# Altium project Data_logger.PrjPcb
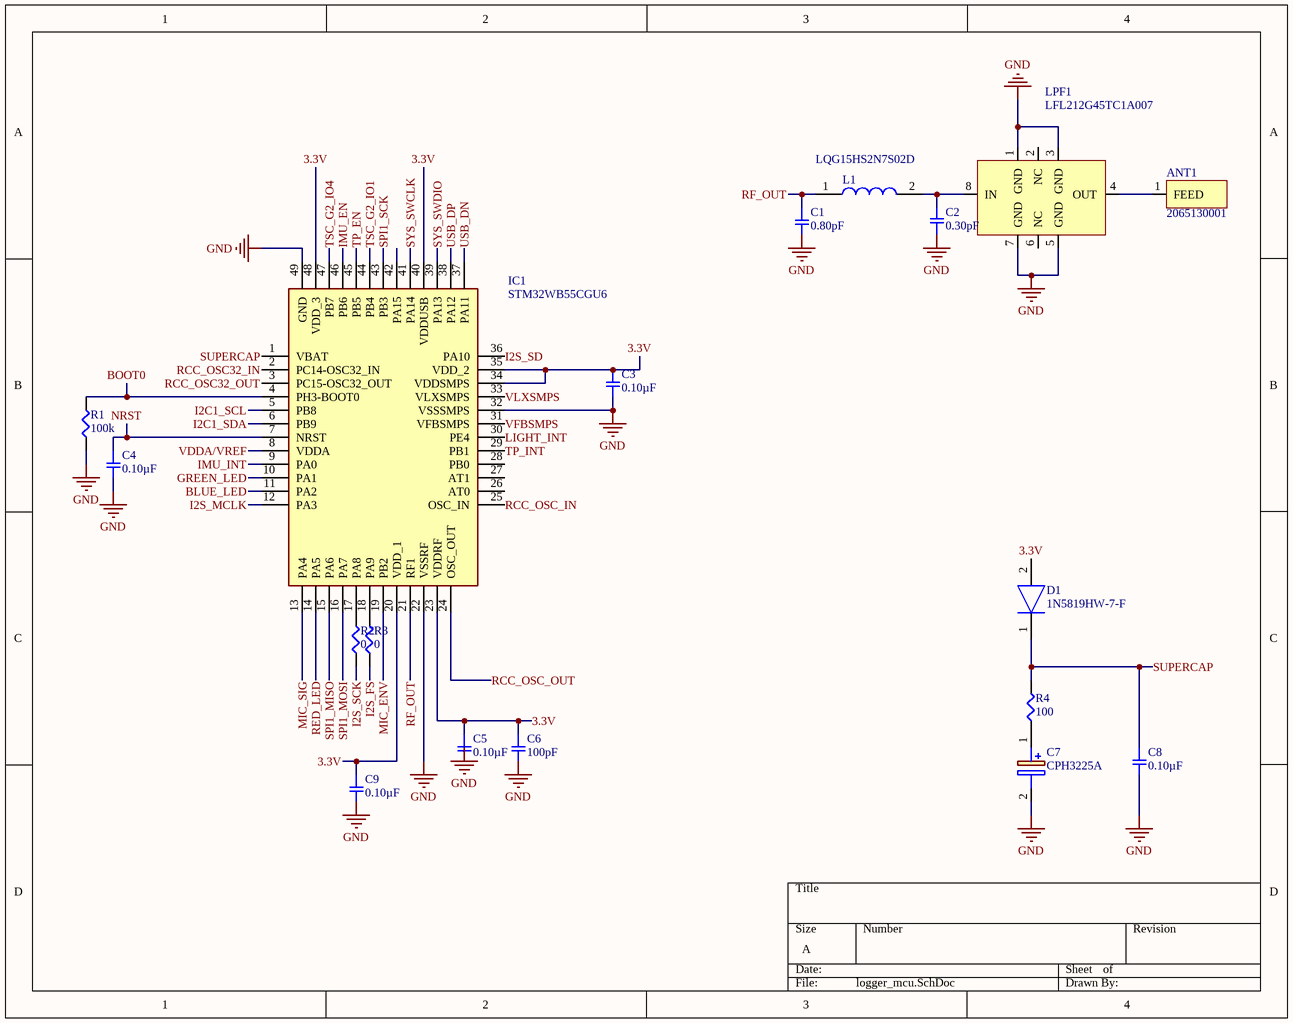
[diagram p0: logger_mcu.SchDoc]
5 sheets, 93 parts. Net scope: global (net labels, ports and power ports of the same name join across sheets).
Board files: Copy of logger_layout_v2.PcbDoc, logger_layout.PcbDoc
Sheets:
  logger_mcu.SchDoc
  logger_sensors.SchDoc
  logger_power.SchDoc
  logger_periph.SchDoc
  logger_connector.SchDoc

## Sheet logger_mcu.SchDoc
size A

### Parts
ANT1  2065130001  [2065130001]
C1  0.80pF  [SMD-0402C]
C2  0.30pF  [SMD-0402C]
C3  0.10µF  [SMD-0402C]
C4  0.10µF  [SMD-0402C]
C5  0.10µF  [SMD-0402C]
C6  100pF  [SMD-0402C]
C7  CPH3225A  [CPH3225A]
C8  0.10µF  [SMD-0402C]
C9  0.10µF  [SMD-0402C]
D1  1N5819HW-7-F  [SOD3716X145N]
IC1  STM32WB55CGU6  [QFN50P700X700X65-49N-D]
L1  LQG15HS2N7S02D  [INDC1005X55N]
LPF1  LFL212G45TC1A007  [LFL212G45TC1A007]
R1  100k  [SMD-0402-RES]
R2  0  [SMD-0402-RES]
R3  0  [SMD-0402-RES]
R4  100  [SMD-0402-RES]

### Nets
GND: C1.2 C2.1 C3.2 C4.2 C6.2 C7.2(-) C8.2 C9.2 IC1.22(VSSRF) IC1.32(VSSSMPS) IC1.49(GND) LPF1.1(GND) LPF1.3(GND) LPF1.5(GND) LPF1.7(GND) R1.1
3.3V: C3.1 C5.1 C6.1 C9.1 D1.2(A) IC1.20(VDD_1) IC1.23(VDDRF) IC1.34(VDDSMPS) IC1.35(VDD_2) IC1.40(VDDUSB) IC1.48(VDD_3)
BLUE_LED: IC1.11(PA2)
BOOT0: IC1.4(PH3-BOOT0) R1.2
GREEN_LED: IC1.10(PA1)
I2C1_SCL: IC1.5(PB8)
I2C1_SDA: IC1.6(PB9)
I2S_FS: R3.1
I2S_MCLK: IC1.12(PA3)
I2S_SCK: R2.1
I2S_SD: IC1.36(PA10)
IMU_EN: IC1.46(PB6)
IMU_INT: IC1.9(PA0)
LIGHT_INT: IC1.30(PE4)
MIC_ENV: IC1.19(PB2)
MIC_SIG: IC1.13(PA4)
NRST: C4.1 IC1.7(NRST)
RCC_OSC32_IN: IC1.2(PC14-OSC32_IN)
RCC_OSC32_OUT: IC1.3(PC15-OSC32_OUT)
RCC_OSC_IN: IC1.25(OSC_IN)
RCC_OSC_OUT: IC1.24(OSC_OUT)
RED_LED: IC1.14(PA5)
RF_OUT: C1.1 IC1.21(RF1) L1.1
SPI1_MISO: IC1.15(PA6)
SPI1_MOSI: IC1.16(PA7)
SPI1_SCK: IC1.43(PB3)
SUPERCAP: C8.1 D1.1(K) IC1.1(VBAT) R4.2
SYS_SWCLK: IC1.41(PA14)
SYS_SWDIO: IC1.39(PA13)
TP_EN: IC1.45(PB5)
TP_INT: IC1.29(PB1)
TSC_G2_IO1: IC1.44(PB4)
TSC_G2_IO4: IC1.47(PB7)
USB_DN: IC1.37(PA11)
USB_DP: IC1.38(PA12)
VDDA/VREF: IC1.8(VDDA)
VFBSMPS: IC1.31(VFBSMPS)
VLXSMPS: IC1.33(VLXSMPS)
NetANT1_1: ANT1.1(FEED) LPF1.4(OUT)
NetC2_2: C2.2 L1.2 LPF1.8(IN)
NetC7_1: C7.1(+) R4.1
NetIC1_17: IC1.17(PA8) R2.2
NetIC1_18: IC1.18(PA9) R3.2

Not connected (* = marked no-connect by the designer): C5 2; IC1 26(AT0) 27(AT1) 28(PB0) 42(PA15); LPF1 2(NC) 6(NC)

### Notes on the sheet
- Labels drawn without touching a wire or pin: GND

### Library data of the parts
C1 = GRM1555C1HR80BA01D: CAP CER 0.8PF 50V NP0 0402; Manufacturer: Murata Electronics North America; Factory Stock: 0; Unit Price (USD): 0.1; Minimum Quantity: 1; Tolerance: ±0.1pF; Temperature Coefficient: C0G, NP0; Datasheets: http://www.murata.com/~/media/webrenewal/support/library/catalog/products/capacitor/mlcc/c02e.pdf; Image: //media.digikey.com/Renders/Murata%20Renders/ZRB-SERIES-0402.jpg; Digi-Key Part Number: 490-6269-1-ND; Part Number: GRM1555C1HR80BA01D; Quantity Available: 38847; @ qty: 0; Packaging: Cut Tape (CT); Series: GRM; Part Status: Active; Value: 0.80pF; Voltage: 50V; Operating Temperature: -55°C ~ 125°C; Features: -; Ratings: -; Applications: General Purpose; Mounting Type: Surface Mount, MLCC; Package / Case: 0402 (1005 Metric); Size / Dimension: 0.039" L x 0.020" W (1.00mm x 0.50mm); Height - Seated (Max): -; Thickness (Max): 0.022" (0.55mm); Lead Spacing: -; Lead Style: -
C2 = GRM1555C1HR30WA01D: CAP CER 0.3PF 50V NP0 0402; Manufacturer: Murata Electronics North America; Factory Stock: 0; Unit Price (USD): 0.16; Minimum Quantity: 1; Tolerance: ±0.05pF; Temperature Coefficient: C0G, NP0; Datasheets: http://www.murata.com/~/media/webrenewal/support/library/catalog/products/capacitor/mlcc/c02e.pdf; Image: //media.digikey.com/Renders/Murata%20Renders/ZRB-SERIES-0402.jpg; Digi-Key Part Number: 490-6261-1-ND; Part Number: GRM1555C1HR30WA01D; Quantity Available: 61475; @ qty: 0; Packaging: Cut Tape (CT); Series: GRM; Part Status: Active; Value: 0.30pF; Voltage: 50V; Operating Temperature: -55°C ~ 125°C; Features: -; Ratings: -; Applications: General Purpose; Mounting Type: Surface Mount, MLCC; Package / Case: 0402 (1005 Metric); Size / Dimension: 0.039" L x 0.020" W (1.00mm x 0.50mm); Height - Seated (Max): -; Thickness (Max): 0.022" (0.55mm); Lead Spacing: -; Lead Style: -
C3-C5 C8 C9 = GCM155R71C104KA55D: CAP CER 0.1UF 16V X7R 0402; Manufacturer: Murata Electronics North America; Factory Stock: 0; Unit Price (USD): 0.1; Minimum Quantity: 1; Tolerance: ±10%; Datasheets: http://www.murata.com/~/media/webrenewal/support/library/catalog/products/capacitor/mlcc/c03e.ashx; Image: //media.digikey.com/Renders/Murata%20Renders/ZRB-SERIES-0402.jpg; Digi-Key Part Number: 490-4759-1-ND; Part Number: GCM155R71C104KA55D; Quantity Available: 734194; @ qty: 0; Packaging: Cut Tape (CT); Series: GCM; Part Status: Active; Value: 0.10µF; Voltage: 16V; Temperature Coefficient: X7R; Operating Temperature: -55°C ~ 125°C; Features: -; Ratings: AEC-Q200; Applications: Automotive; Mounting Type: Surface Mount, MLCC; Package / Case: 0402 (1005 Metric); Size / Dimension: 0.039" L x 0.020" W (1.00mm x 0.50mm); Height - Seated (Max): -; Thickness (Max): 0.022" (0.55mm); Lead Spacing: -; Lead Style: -
C6 = GCM1555C1H101JA16D: CAP CER 100PF 50V NP0 0402; Manufacturer: Murata Electronics North America; Factory Stock: 0; Unit Price (USD): 0.1; Minimum Quantity: 1; Tolerance: ±5%; Temperature Coefficient: C0G, NP0; Datasheets: http://www.murata.com/~/media/webrenewal/support/library/catalog/products/capacitor/mlcc/c03e.ashx; Image: //media.digikey.com/Renders/Murata%20Renders/ZRB-SERIES-0402.jpg; Digi-Key Part Number: 490-10669-1-ND; Part Number: GCM1555C1H101JA16D; Quantity Available: 61397; @ qty: 0; Packaging: Cut Tape (CT); Series: GCM; Part Status: Active; Value: 100pF; Voltage: 50V; Operating Temperature: -55°C ~ 125°C; Features: -; Ratings: AEC-Q200; Applications: Automotive; Mounting Type: Surface Mount, MLCC; Package / Case: 0402 (1005 Metric); Size / Dimension: 0.039" L x 0.020" W (1.00mm x 0.50mm); Height - Seated (Max): -; Thickness (Max): 0.022" (0.55mm); Lead Spacing: -; Lead Style: -
C7 = CPH3225A: Capacitor Polarised; Manufacturer_Name: Seiko Instruments Micro Energy; Datasheet Link: https://www.sii.co.jp/en/me/datasheets/chip-capacitor/cph3225a/; Height: 1mm; Manufacturer_Part_Number: CPH3225A; Mouser Part Number: 628-CPH3225A; Mouser Price/Stock: https://www.mouser.com/Search/Refine.aspx?Keyword=628-CPH3225A
D1 = 1N5819HW-7-F: Diode; Manufacturer_Name: Diodes Inc.; Allied_Number: 70437201; Datasheet Link: http://www.diodes.com/_files/datasheets/ds30217.pdf; Height: 1.45mm; Manufacturer_Part_Number: 1N5819HW-7-F; Mouser Part Number: 621-1N5819HW-F; Mouser Price/Stock: https://www.mouser.com/Search/Refine.aspx?Keyword=621-1N5819HW-F; RS Part Number: 7082197P; RS Price/Stock: http://uk.rs-online.com/web/p/products/7082197P; Allied Price/Stock: http://www.alliedelec.com/diodes-inc-1n5819hw-7-f/70437201/
IC1 = STM32WB55CGU6: Integrated Circuit; Manufacturer_Name: STMicroelectronics; Datasheet Link: https://www.st.com/en/microcontrollers/stm32wb55cg.html; Height: 0.65mm; Manufacturer_Part_Number: STM32WB55CGU6; Mouser Part Number: 511-STM32WB55CGU6; Mouser Price/Stock: https://www.mouser.com/Search/Refine.aspx?Keyword=511-STM32WB55CGU6
L1 = LQG15HS2N7S02D: Inductor; Manufacturer_Name: Murata Electronics; Datasheet Link: https://www.arrow.com/en/products/lqg15hs2n7s02d/murata-manufacturing; Height: 0.55mm; Manufacturer_Part_Number: LQG15HS2N7S02D
R1 = ERJ-2RKF1003X: RES SMD 100K OHM 1% 1/10W 0402; Manufacturer: Panasonic Electronic Components; Factory Stock: 0; Unit Price (USD): 0.00496; @ qty: 1500; Minimum Quantity: 1; Power (Watts): 0.1W, 1/10W; Temperature Coefficient: ±100ppm/°C; Part Number: ERJ-2RKF1003X; Datasheets: http://industrial.panasonic.com/www-cgi/jvcr13pz.cgi?E+PZ+3+AOA0002+ERJ2RKF1003X+7+WW; Image: //media.digikey.com/Photos/Panasonic%20Photos/ERJ-PA2-Series.jpg; Digi-Key Part Number: P100KLCT-ND; Quantity Available: 2645965; Packaging: Cut Tape (CT); Series: ERJ; Part Status: Active; Value: 100k; Tolerance: ±1%; Composition: Thick Film; Features: Automotive AEC-Q200; Operating Temperature: -55°C ~ 155°C; Package / Case: 0402 (1005 Metric); Supplier Device Package: 0402; Size / Dimension: 0.039" L x 0.020" W (1.00mm x 0.50mm); Height - Seated (Max): 0.016" (0.40mm); Number of Terminations: 2; Failure Rate: -
R2 R3 = ERJ-2GEJ103X: RES SMD 0K OHM 5% 1/10W 0402; Manufacturer: Panasonic Electronic Components; Unit Price (USD): 0.00350; @ qty: 1500; Minimum Quantity: 1; Power (Watts): 0.1W, 1/10W; Temperature Coefficient: ±200ppm/°C; Part Number: ERJ-2GEJ103X; Datasheets: http://industrial.panasonic.com/www-cgi/jvcr13pz.cgi?E+PZ+3+AOA0001+ERJ2GEJ103X+7+WW; Image: //media.digikey.com/Photos/Panasonic%20Photos/ERJ-PA2-Series.jpg; Digi-Key Part Number: P10KJCT-ND; Quantity Available: 2560215; Factory Stock: 0; Packaging: Cut Tape (CT); Series: ERJ; Part Status: Active; Value: 0; Tolerance: ±5%; Composition: Thick Film; Features: Automotive AEC-Q200; Operating Temperature: -55°C ~ 155°C; Package / Case: 0402 (1005 Metric); Supplier Device Package: 0402; Size / Dimension: 0.039" L x 0.020" W (1.00mm x 0.50mm); Height - Seated (Max): 0.016" (0.40mm); Number of Terminations: 2; Failure Rate: -
R4 = ERJ-2RKF1003X: RES SMD 100 OHM 5% 1/4W 0603; Manufacturer: Panasonic Electronic Components; Factory Stock: 0; Unit Price (USD): 0.00496; @ qty: 1500; Minimum Quantity: 1; Tolerance: ±1%; Power (Watts): 0.1W, 1/10W; Temperature Coefficient: ±100ppm/°C; Part Number: ERJ-2RKF1003X; Datasheets: http://industrial.panasonic.com/www-cgi/jvcr13pz.cgi?E+PZ+3+AOA0002+ERJ2RKF1003X+7+WW; Image: //media.digikey.com/Photos/Panasonic%20Photos/ERJ-PA2-Series.jpg; Digi-Key Part Number: P100KLCT-ND; Quantity Available: 2645965; Packaging: Cut Tape (CT); Series: ERJ; Part Status: Active; Value: 100; Composition: Thick Film; Features: Automotive AEC-Q200; Operating Temperature: -55°C ~ 155°C; Package / Case: 0603 (1608 Metric); Supplier Device Package: 0603; Size / Dimension: 0.039" L x 0.020" W (1.00mm x 0.50mm); Height - Seated (Max): 0.016" (0.40mm); Number of Terminations: 2; Failure Rate: -

## Sheet logger_sensors.SchDoc
size A
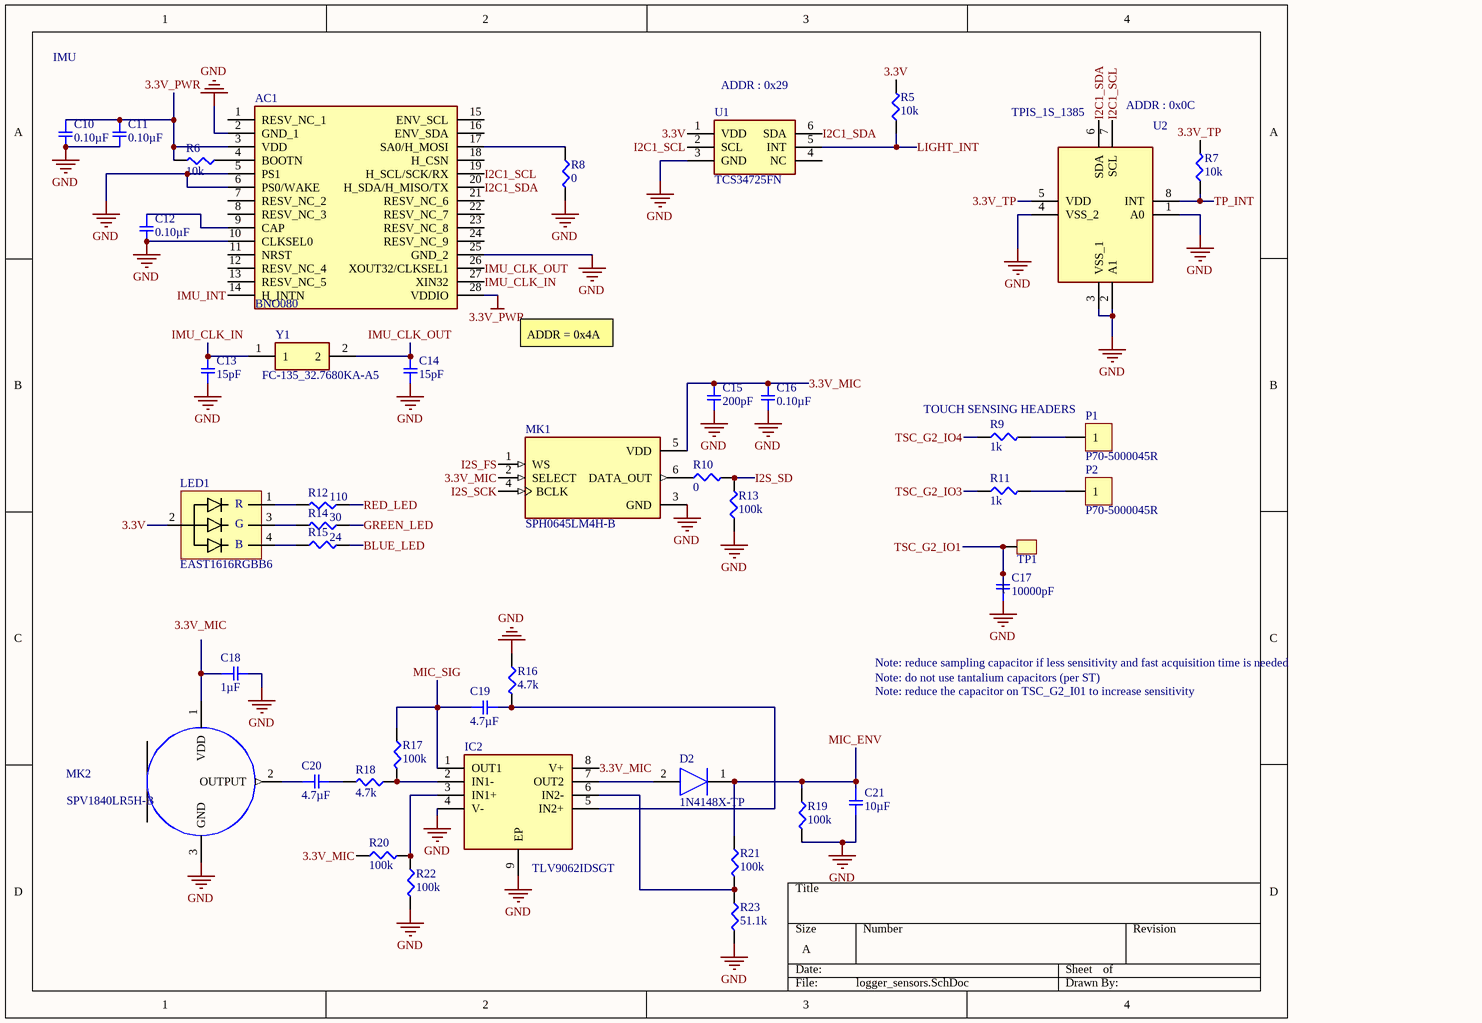
[diagram p1: logger_sensors.SchDoc]

### Parts
AC1  BNO080  [BNO080]
C10  0.10µF  [CAPC1005X55N]
C11  0.10µF  [CAPC1005X55N]
C12  0.10µF  [CAPC1005X55N]
C13  15pF  [CAPC1005X55N]
C14  15pF  [CAPC1005X55N]
C15  200pF  [CAPC1005X55N]
C16  0.10µF  [CAPC1005X55N]
C17  10000pF  [SMD-0402C]
C18  1µF  [SMD-0402C]
C19  4.7µF  [SMD-0402C]
C20  4.7µF  [SMD-0402C]
C21  10µF  [CAPC1005X55N]
D2  1N4148X-TP  [SODFL1608X70N]
IC2  TLV9062IDSGT  [SON50P200X200X80-9N]
LED1  EAST1616RGBB6  [EAST1616RGBB6]
MK1  SPH0645LM4H-B  [MIC_SPH0645LM4H-B]
MK2  SPV1840LR5H-B  [*MIC_SPV1840LR5H-B]
P1  P70-5000045R  [P70-5000045R]
P2  P70-5000045R  [P70-5000045R]
R5  10k  [SMD-0402-RES]
R6  10k  [SMD-0402-RES]
R7  10k  [SMD-0402-RES]
R8  0  [SMD-0402-RES]
R9  1k  [SMD-0402-RES]
R10  0  [SMD-0402-RES]
R11  1k  [SMD-0402-RES]
R12  110  [SMD-0402-RES]
R13  100k  [SMD-0402-RES]
R14  30  [SMD-0402-RES]
R15  24  [SMD-0402-RES]
R16  4.7k  [SMD-0402-RES]
R17  100k  [SMD-0402-RES]
R18  4.7k  [SMD-0402-RES]
R19  100k  [SMD-0402-RES]
R20  100k  [SMD-0402-RES]
R21  100k  [SMD-0402-RES]
R22  100k  [SMD-0402-RES]
R23  51.1k  [SMD-0402-RES]
TP1  TestPoint  [TestPoint_0.4mm]  (value not drawn)
U1  TCS34725FN  [FN_1]
U2  TPIS_1S_1385  [TPIS_1S_1385]  (value not drawn)
Y1  FC-135_32.7680KA-A5  [FC135327680KAAG0]

### Nets
3.3V_PWR: AC1.3(VDD) AC1.28(VDDIO) C10.1 C11.1 R6.2
GND: AC1.2(GND_1) AC1.5(PS1) AC1.6(PS0/WAKE) AC1.10(CLKSEL0) AC1.25(GND_2) C10.2 C11.2 C12.2 C13.2 C14.2 C15.2 C16.2 C17.1 C18.2 C21.2 IC2.4(V-) IC2.9(EP) MK1.3(GND) MK2.3(GND) R8.2 R13.1 R16.1 R19.2 R22.2 R23.2 U1.3(GND) U2.1(A0) U2.2(A1) U2.3(VSS_1) U2.4(VSS_2)
3.3V: LED1.2 R5.2 U1.1(VDD)
3.3V_MIC: C15.1 C16.1 IC2.8(V+) MK1.2(SELECT) MK1.5(VDD) R20.1
3.3V_TP: R7.2 U2.5(VDD)
BLUE_LED: R15.2
GREEN_LED: R14.1
I2C1_SCL: AC1.19(H_SCL/SCK/RX) U1.2(SCL) U2.7(SCL)
I2C1_SDA: AC1.20(H_SDA/H_MISO/TX) U1.6(SDA) U2.6(SDA)
I2S_FS: MK1.1(WS)
I2S_SCK: MK1.4(BCLK)
I2S_SD: R10.2 R13.2
IMU_CLK_IN: AC1.27(XIN32) C13.1 Y1.1
IMU_CLK_OUT: AC1.26(XOUT32/CLKSEL1) C14.1 Y1.2
IMU_INT: AC1.14(H_INTN)
LIGHT_INT: R5.1 U1.5(INT)
MIC_ENV: C21.1 D2.1(K) R19.1 R21.1
MIC_SIG: C19.1 IC2.1(OUT1) R17.1
RED_LED: R12.1
TP_INT: R7.1 U2.8(INT)
TSC_G2_IO1: C17.2 TP1.1
TSC_G2_IO3: R11.1
TSC_G2_IO4: R9.1
NetAC1_4: AC1.4(BOOTN) R6.1
NetAC1_9: AC1.9(CAP) C12.1
NetAC1_17: AC1.17(SA0/H_MOSI) R8.1
NetC18_1: C18.1 MK2.1(VDD)
NetC19_2: C19.2 IC2.5(IN2+) R16.2
NetC20_1: C20.1 MK2.2(OUTPUT)
NetC20_2: C20.2 R18.2
NetD2_2: D2.2(A) IC2.7(OUT2)
NetIC2_2: IC2.2(IN1-) R17.2 R18.1
NetIC2_3: IC2.3(IN1+) R20.2 R22.1
NetIC2_6: IC2.6(IN2-) R21.2 R23.1
NetLED1_1: LED1.1 R12.2
NetLED1_3: LED1.3 R14.2
NetLED1_4: LED1.4 R15.1
NetP1_1: P1.1 R9.2
NetP2_1: P2.1 R11.2

Not connected (* = marked no-connect by the designer): AC1 1(RESV_NC_1) 7(RESV_NC_2) 8(RESV_NC_3) 11(NRST) 12(RESV_NC_4) 13(RESV_NC_5) 15(ENV_SCL) 16(ENV_SDA) 18(H_CSN) 21(RESV_NC_6) 22(RESV_NC_7) 23(RESV_NC_8) 24(RESV_NC_9); MK1 6(DATA_OUT); R10 1; U1 4(NC)

### Notes on the sheet
- IMU
- (near U1) ADDR : 0x29
- (near U2) TPIS_1S_1385
- ADDR : 0x0C
- ADDR = 0x4A
- (near R9) TOUCH SENSING HEADERS
- Note: reduce sampling capacitor if less sensitivity and fast acquisition time is needed
- Note: do not use tantalium capacitors (per ST)
- Note: reduce the capacitor on TSC_G2_I01 to increase sensitivity
- Labels drawn without touching a wire or pin: 3.3V_MIC
- (in symbol EAST1616RGBB6) R; G; B

### Library data of the parts
AC1 = BNO080: Accelerometer; Manufacturer_Name: Hillcrest Laboratories; Datasheet Link: http://www.hillcrestlabs.com/download/5a05f340566d07c196001ec1; Height: 1.18mm; Manufacturer_Part_Number: BNO080
C10-C12 C16 = GCM155R71C104KA55D: as C3 on sheet logger_mcu; Datasheets: http://www.murata.com/~/media/webrenewal/support/library/catalog/products/capacitor/mlcc/c03e.ashx; Image: //media.digikey.com/Renders/Murata%20Renders/ZRB-SERIES-0402.jpg; Digi-Key Part Number: 490-4759-1-ND; Part Number: GCM155R71C104KA55D; Quantity Available: 734194; @ qty: 0; Packaging: Cut Tape (CT); Series: GCM; Part Status: Active; Value: 0.10µF; Voltage: 16V; Temperature Coefficient: X7R; Operating Temperature: -55°C ~ 125°C; Features: -; Ratings: AEC-Q200; Applications: Automotive; Mounting Type: Surface Mount, MLCC; Package / Case: 0402 (1005 Metric); Size / Dimension: 0.039" L x 0.020" W (1.00mm x 0.50mm); Height - Seated (Max): -; Thickness (Max): 0.022" (0.55mm); Lead Spacing: -; Lead Style: -
C13 C14 = GCM1555C1H150JA16D: CAP CER 15PF 50V NP0 0402; Manufacturer: Murata Electronics North America; Factory Stock: 0; Unit Price (USD): 0.1; Minimum Quantity: 1; Tolerance: ±5%; Temperature Coefficient: C0G, NP0; Datasheets: http://www.murata.com/~/media/webrenewal/support/library/catalog/products/capacitor/mlcc/c03e.ashx; Image: //media.digikey.com/Renders/Murata%20Renders/ZRB-SERIES-0402.jpg; Digi-Key Part Number: 490-11147-1-ND; Part Number: GCM1555C1H150JA16D; Quantity Available: 6185; @ qty: 0; Packaging: Cut Tape (CT); Series: GCM; Part Status: Active; Value: 15pF; Voltage: 50V; Operating Temperature: -55°C ~ 125°C; Features: -; Ratings: AEC-Q200; Applications: Automotive; Mounting Type: Surface Mount, MLCC; Package / Case: 0402 (1005 Metric); Size / Dimension: 0.039" L x 0.020" W (1.00mm x 0.50mm); Height - Seated (Max): -; Thickness (Max): 0.022" (0.55mm); Lead Spacing: -; Lead Style: -
C15 = GCM155R71C104KA55D: CAP CER 200pF 16V X7R 0402; Manufacturer: Murata Electronics North America; Factory Stock: 0; Unit Price (USD): 0.1; Minimum Quantity: 1; Tolerance: ±10%; Datasheets: http://www.murata.com/~/media/webrenewal/support/library/catalog/products/capacitor/mlcc/c03e.ashx; Image: //media.digikey.com/Renders/Murata%20Renders/ZRB-SERIES-0402.jpg; Digi-Key Part Number: 490-4759-1-ND; Part Number: GCM155R71C104KA55D; Quantity Available: 734194; @ qty: 0; Packaging: Cut Tape (CT); Series: GCM; Part Status: Active; Value: 200pF; Voltage: 16V; Temperature Coefficient: X7R; Operating Temperature: -55°C ~ 125°C; Features: -; Ratings: AEC-Q200; Applications: Automotive; Mounting Type: Surface Mount, MLCC; Package / Case: 0402 (1005 Metric); Size / Dimension: 0.039" L x 0.020" W (1.00mm x 0.50mm); Height - Seated (Max): -; Thickness (Max): 0.022" (0.55mm); Lead Spacing: -; Lead Style: -
C17 = GCM155R71H103KA55D: CAP CER 10000PF 50V X7R 0402; Manufacturer: Murata Electronics North America; Factory Stock: 0; Unit Price (USD): 0.1; Minimum Quantity: 1; Tolerance: ±10%; Datasheets: http://www.murata.com/~/media/webrenewal/support/library/catalog/products/capacitor/mlcc/c03e.ashx; Image: //media.digikey.com/Renders/Murata%20Renders/ZRB-SERIES-0402.jpg; Digi-Key Part Number: 490-4762-1-ND; Part Number: GCM155R71H103KA55D; Quantity Available: 650067; @ qty: 0; Packaging: Cut Tape (CT); Series: GCM; Part Status: Active; Value: 10000pF; Voltage: 50V; Temperature Coefficient: X7R; Operating Temperature: -55°C ~ 125°C; Features: -; Ratings: AEC-Q200; Applications: Automotive; Mounting Type: Surface Mount, MLCC; Package / Case: 0402 (1005 Metric); Size / Dimension: 0.039" L x 0.020" W (1.00mm x 0.50mm); Height - Seated (Max): -; Thickness (Max): 0.022" (0.55mm); Lead Spacing: -; Lead Style: -
C18 = GCM155C71A105KE38D: CAP CER 1UF 10V X7S 0402; Manufacturer: Murata Electronics North America; Factory Stock: 0; Unit Price (USD): 0.12; Minimum Quantity: 1; Tolerance: ±10%; Datasheets: http://www.murata.com/~/media/webrenewal/support/library/catalog/products/capacitor/mlcc/c03e.ashx; Image: //media.digikey.com/Renders/Murata%20Renders/ZRB-SERIES-0402.jpg; Digi-Key Part Number: 490-13409-1-ND; Part Number: GCM155C71A105KE38D; Quantity Available: 7240; @ qty: 0; Packaging: Cut Tape (CT); Series: GCM; Part Status: Active; Value: 1µF; Voltage: 10V; Temperature Coefficient: X7S; Operating Temperature: -55°C ~ 125°C; Features: -; Ratings: AEC-Q200; Applications: Automotive; Mounting Type: Surface Mount, MLCC; Package / Case: 0402 (1005 Metric); Size / Dimension: 0.039" L x 0.020" W (1.00mm x 0.50mm); Height - Seated (Max): -; Thickness (Max): 0.022" (0.55mm); Lead Spacing: -; Lead Style: -
C19 C20 = GRM155R60J475ME47D: CAP CER 4.7UF 6.3V X5R 0402; Manufacturer: Murata Electronics North America; Factory Stock: 0; Unit Price (USD): 0.14; Minimum Quantity: 1; Tolerance: ±20%; Datasheets: http://www.murata.com/~/media/webrenewal/support/library/catalog/products/capacitor/mlcc/c02e.pdf; Image: //media.digikey.com/Renders/Murata%20Renders/ZRB-SERIES-0402.jpg; Digi-Key Part Number: 490-5915-1-ND; Part Number: GRM155R60J475ME47D; Quantity Available: 1963747; @ qty: 0; Packaging: Cut Tape (CT); Series: GRM; Part Status: Active; Value: 4.7µF; Voltage: 6.3V; Temperature Coefficient: X5R; Operating Temperature: -55°C ~ 85°C; Features: Derating Recommended; Ratings: -; Applications: General Purpose; Mounting Type: Surface Mount, MLCC; Package / Case: 0402 (1005 Metric); Size / Dimension: 0.039" L x 0.020" W (1.00mm x 0.50mm); Height - Seated (Max): -; Thickness (Max): 0.024" (0.60mm); Lead Spacing: -; Lead Style: -
C21 = GCM155R71C104KA55D: CAP CER 10UF 16V X7R 0402; Manufacturer: Murata Electronics North America; Factory Stock: 0; Unit Price (USD): 0.1; Minimum Quantity: 1; Tolerance: ±10%; Datasheets: http://www.murata.com/~/media/webrenewal/support/library/catalog/products/capacitor/mlcc/c03e.ashx; Image: //media.digikey.com/Renders/Murata%20Renders/ZRB-SERIES-0402.jpg; Digi-Key Part Number: 490-4759-1-ND; Part Number: GCM155R71C104KA55D; Quantity Available: 734194; @ qty: 0; Packaging: Cut Tape (CT); Series: GCM; Part Status: Active; Value: 10µF; Voltage: 16V; Temperature Coefficient: X7R; Operating Temperature: -55°C ~ 125°C; Features: -; Ratings: AEC-Q200; Applications: Automotive; Mounting Type: Surface Mount, MLCC; Package / Case: 0402 (1005 Metric); Size / Dimension: 0.039" L x 0.020" W (1.00mm x 0.50mm); Height - Seated (Max): -; Thickness (Max): 0.022" (0.55mm); Lead Spacing: -; Lead Style: -
D2 = 1N4148X-TP: Diode; Manufacturer_Name: Micro Commercial Components (MCC); Datasheet Link: http://www.mouser.com/ds/2/258/1N4148X(SOD-523)-349105.pdf; Height: 0.7mm; Manufacturer_Part_Number: 1N4148X-TP; Mouser Part Number: 833-1N4148X-TP; Mouser Price/Stock: https://www.mouser.com/Search/Refine.aspx?Keyword=833-1N4148X-TP
IC2 = TLV9062IDSGT: Integrated Circuit; Manufacturer_Name: Texas Instruments; Datasheet Link: http://www.ti.com/lit/gpn/TLV9062; Height: 0.8mm; Manufacturer_Part_Number: TLV9062IDSGT; Mouser Part Number: 595-TLV9062IDSGT; Mouser Price/Stock: https://www.mouser.com/Search/Refine.aspx?Keyword=595-TLV9062IDSGT
MK1 = SPH0645LM4H-B: 20 Hz ~ 10 kHz digitale IÂ²S-Mikrofon-MEMS _Silizium_ 1,62 V ~ 3,6 V omnidirektionale _-26 dB Â± 3 dB bei 94 dB SPL_ LÃ¶tpads; MF: Knowles; Package: SIP-7 Bourns; Digi-Key_Purchase_URL: https://www.digikey.ch/product-detail/en/knowles/SPH0645LM4H-B/423-1405-1-ND/5332432?utm_source=snapeda&utm_medium=aggregator&utm_campaign=symbol; Digi-Key_Part_Number: 423-1405-1-ND; SnapEDA_Link: https://www.snapeda.com/parts/SPH0645LM4H-B/Knowles/view-part/229820/?ref=snap; MP: SPH0645LM4H-B; Value: *
MK2 = SPV1840LR5H-B: Mic Mems Analog; MF: Knowles; MP: SPV1840LR5H-B; Package: 0805 Knowles; SnapEDA_Link: https://www.snapeda.com/parts/SPV1840LR5H-B/Knowles/view-part/?ref=snap; Availability: Unavailable; Price: None; Value: *
R5-R7 = ERJ-2GEJ103X: RES SMD 10K OHM 5% 1/10W 0402; Manufacturer: Panasonic Electronic Components; Factory Stock: 0; Unit Price (USD): 0.00350; @ qty: 1500; Minimum Quantity: 1; Power (Watts): 0.1W, 1/10W; Temperature Coefficient: ±200ppm/°C; Part Number: ERJ-2GEJ103X; Datasheets: http://industrial.panasonic.com/www-cgi/jvcr13pz.cgi?E+PZ+3+AOA0001+ERJ2GEJ103X+7+WW; Image: //media.digikey.com/Photos/Panasonic%20Photos/ERJ-PA2-Series.jpg; Digi-Key Part Number: P10KJCT-ND; Quantity Available: 2560215; Packaging: Cut Tape (CT); Series: ERJ; Part Status: Active; Value: 10k; Tolerance: ±5%; Composition: Thick Film; Features: Automotive AEC-Q200; Operating Temperature: -55°C ~ 155°C; Package / Case: 0402 (1005 Metric); Supplier Device Package: 0402; Size / Dimension: 0.039" L x 0.020" W (1.00mm x 0.50mm); Height - Seated (Max): 0.016" (0.40mm); Number of Terminations: 2; Failure Rate: -
R8 R10 = ERJ-2GEJ103X: as R2 on sheet logger_mcu; Part Number: ERJ-2GEJ103X; Datasheets: http://industrial.panasonic.com/www-cgi/jvcr13pz.cgi?E+PZ+3+AOA0001+ERJ2GEJ103X+7+WW; Image: //media.digikey.com/Photos/Panasonic%20Photos/ERJ-PA2-Series.jpg; Digi-Key Part Number: P10KJCT-ND; Quantity Available: 2560215; Factory Stock: 0; Packaging: Cut Tape (CT); Series: ERJ; Part Status: Active; Value: 0; Tolerance: ±5%; Composition: Thick Film; Features: Automotive AEC-Q200; Operating Temperature: -55°C ~ 155°C; Package / Case: 0402 (1005 Metric); Supplier Device Package: 0402; Size / Dimension: 0.039" L x 0.020" W (1.00mm x 0.50mm); Height - Seated (Max): 0.016" (0.40mm); Number of Terminations: 2; Failure Rate: -
R9 R11 = ERJ-2GEJ102X: RES SMD 1K OHM 5% 1/10W 0402; Manufacturer: Panasonic Electronic Components; Factory Stock: 0; Unit Price (USD): 0.00350; @ qty: 1500; Minimum Quantity: 1; Power (Watts): 0.1W, 1/10W; Temperature Coefficient: ±200ppm/°C; Part Number: ERJ-2GEJ102X; Datasheets: http://industrial.panasonic.com/www-cgi/jvcr13pz.cgi?E+PZ+3+AOA0001+ERJ2GEJ102X+7+WW; Image: //media.digikey.com/Photos/Panasonic%20Photos/ERJ-PA2-Series.jpg; Digi-Key Part Number: P1.0KJCT-ND; Quantity Available: 1939857; Packaging: Cut Tape (CT); Series: ERJ; Part Status: Active; Value: 1k; Tolerance: ±5%; Composition: Thick Film; Features: Automotive AEC-Q200; Operating Temperature: -55°C ~ 155°C; Package / Case: 0402 (1005 Metric); Supplier Device Package: 0402; Size / Dimension: 0.039" L x 0.020" W (1.00mm x 0.50mm); Height - Seated (Max): 0.016" (0.40mm); Number of Terminations: 2; Failure Rate: -
R12 R14 R15 = ERJ-2GEJ103X: RES SMD 110 OHM 5% 1/10W 0402; Manufacturer: Panasonic Electronic Components; Factory Stock: 0; Unit Price (USD): 0.00350; @ qty: 1500; Minimum Quantity: 1; Power (Watts): 0.1W, 1/10W; Temperature Coefficient: ±200ppm/°C; Part Number: ERJ-2GEJ103X; Datasheets: http://industrial.panasonic.com/www-cgi/jvcr13pz.cgi?E+PZ+3+AOA0001+ERJ2GEJ103X+7+WW; Image: //media.digikey.com/Photos/Panasonic%20Photos/ERJ-PA2-Series.jpg; Digi-Key Part Number: P10KJCT-ND; Quantity Available: 2560215; Packaging: Cut Tape (CT); Series: ERJ; Part Status: Active; Tolerance: ±5%; Composition: Thick Film; Features: Automotive AEC-Q200; Operating Temperature: -55°C ~ 155°C; Package / Case: 0402 (1005 Metric); Supplier Device Package: 0402; Size / Dimension: 0.039" L x 0.020" W (1.00mm x 0.50mm); Height - Seated (Max): 0.016" (0.40mm); Number of Terminations: 2; Failure Rate: -
  R12: Value: 110
  R14: Value: 30
  R15: Value: 24
R13 R17 R19-R22 = ERJ-2GEJ103X: RES SMD 100K OHM 5% 1/10W 0402; Manufacturer: Panasonic Electronic Components; Factory Stock: 0; Unit Price (USD): 0.00350; @ qty: 1500; Minimum Quantity: 1; Power (Watts): 0.1W, 1/10W; Temperature Coefficient: ±200ppm/°C; Part Number: ERJ-2GEJ103X; Datasheets: http://industrial.panasonic.com/www-cgi/jvcr13pz.cgi?E+PZ+3+AOA0001+ERJ2GEJ103X+7+WW; Image: //media.digikey.com/Photos/Panasonic%20Photos/ERJ-PA2-Series.jpg; Digi-Key Part Number: P10KJCT-ND; Quantity Available: 2560215; Packaging: Cut Tape (CT); Series: ERJ; Part Status: Active; Value: 100k; Tolerance: ±5%; Composition: Thick Film; Features: Automotive AEC-Q200; Operating Temperature: -55°C ~ 155°C; Package / Case: 0402 (1005 Metric); Supplier Device Package: 0402; Size / Dimension: 0.039" L x 0.020" W (1.00mm x 0.50mm); Height - Seated (Max): 0.016" (0.40mm); Number of Terminations: 2; Failure Rate: -
R16 R18 = ERJ-2GEJ103X: RES SMD 4.7K OHM 5% 1/10W 0402; Manufacturer: Panasonic Electronic Components; Factory Stock: 0; Unit Price (USD): 0.00350; @ qty: 1500; Minimum Quantity: 1; Power (Watts): 0.1W, 1/10W; Temperature Coefficient: ±200ppm/°C; Part Number: ERJ-2GEJ103X; Datasheets: http://industrial.panasonic.com/www-cgi/jvcr13pz.cgi?E+PZ+3+AOA0001+ERJ2GEJ103X+7+WW; Image: //media.digikey.com/Photos/Panasonic%20Photos/ERJ-PA2-Series.jpg; Digi-Key Part Number: P10KJCT-ND; Quantity Available: 2560215; Packaging: Cut Tape (CT); Series: ERJ; Part Status: Active; Value: 4.7k; Tolerance: ±5%; Composition: Thick Film; Features: Automotive AEC-Q200; Operating Temperature: -55°C ~ 155°C; Package / Case: 0402 (1005 Metric); Supplier Device Package: 0402; Size / Dimension: 0.039" L x 0.020" W (1.00mm x 0.50mm); Height - Seated (Max): 0.016" (0.40mm); Number of Terminations: 2; Failure Rate: -
R23 = ERJ-2GEJ103X: RES SMD 51.1K OHM 5% 1/10W 0402; Manufacturer: Panasonic Electronic Components; Factory Stock: 0; Unit Price (USD): 0.00350; @ qty: 1500; Minimum Quantity: 1; Power (Watts): 0.1W, 1/10W; Temperature Coefficient: ±200ppm/°C; Part Number: ERJ-2GEJ103X; Datasheets: http://industrial.panasonic.com/www-cgi/jvcr13pz.cgi?E+PZ+3+AOA0001+ERJ2GEJ103X+7+WW; Image: //media.digikey.com/Photos/Panasonic%20Photos/ERJ-PA2-Series.jpg; Digi-Key Part Number: P10KJCT-ND; Quantity Available: 2560215; Packaging: Cut Tape (CT); Series: ERJ; Part Status: Active; Value: 51.1k; Tolerance: ±5%; Composition: Thick Film; Features: Automotive AEC-Q200; Operating Temperature: -55°C ~ 155°C; Package / Case: 0402 (1005 Metric); Supplier Device Package: 0402; Size / Dimension: 0.039" L x 0.020" W (1.00mm x 0.50mm); Height - Seated (Max): 0.016" (0.40mm); Number of Terminations: 2; Failure Rate: -
U1 = TCS34725FN: Undefined or Miscellaneous; Manufacturer_Name: ams; Datasheet Link: https://ams.com/jpn/content/download/319364/1117183/file/TCS3472_Datasheet_EN_v2.pdf; Manufacturer_Part_Number: TCS34725FN; Mouser Part Number: 985-TCS34725FN; Mouser Price/Stock: https://www.mouser.com/Search/Refine.aspx?Keyword=985-TCS34725FN; RS Part Number: 1024173P; RS Price/Stock: http://china.rs-online.com/web/p/products/1024173P
U2 = TPIS_1S_1385: Undefined or Miscellaneous; Manufacturer_Name: Excelitas Technologies; Manufacturer_Part_Number: TPIS 1S 1385; Datasheet Link: http://media.digikey.com/pdf/Data%20Sheets/Excelitas%20PDFs/TPiS_1S_1385.pdf
Y1 = FC-135_32.7680KA-A3: Crystal or Oscillator; Manufacturer_Name: Epson Timing; Manufacturer_Part_Number: FC-135 32.7680KA-A5; Datasheet Link: https://support.epson.biz/td/api/doc_check.php?dl=brief_fc-135r_en.pdf; Height: 0mm; Mouser Part Number: 732-FC135-32.76KAA3; Mouser Price/Stock: https://www.mouser.com/Search/Refine.aspx?Keyword=732-FC135-32.76KAA3

## Sheet logger_power.SchDoc
size A
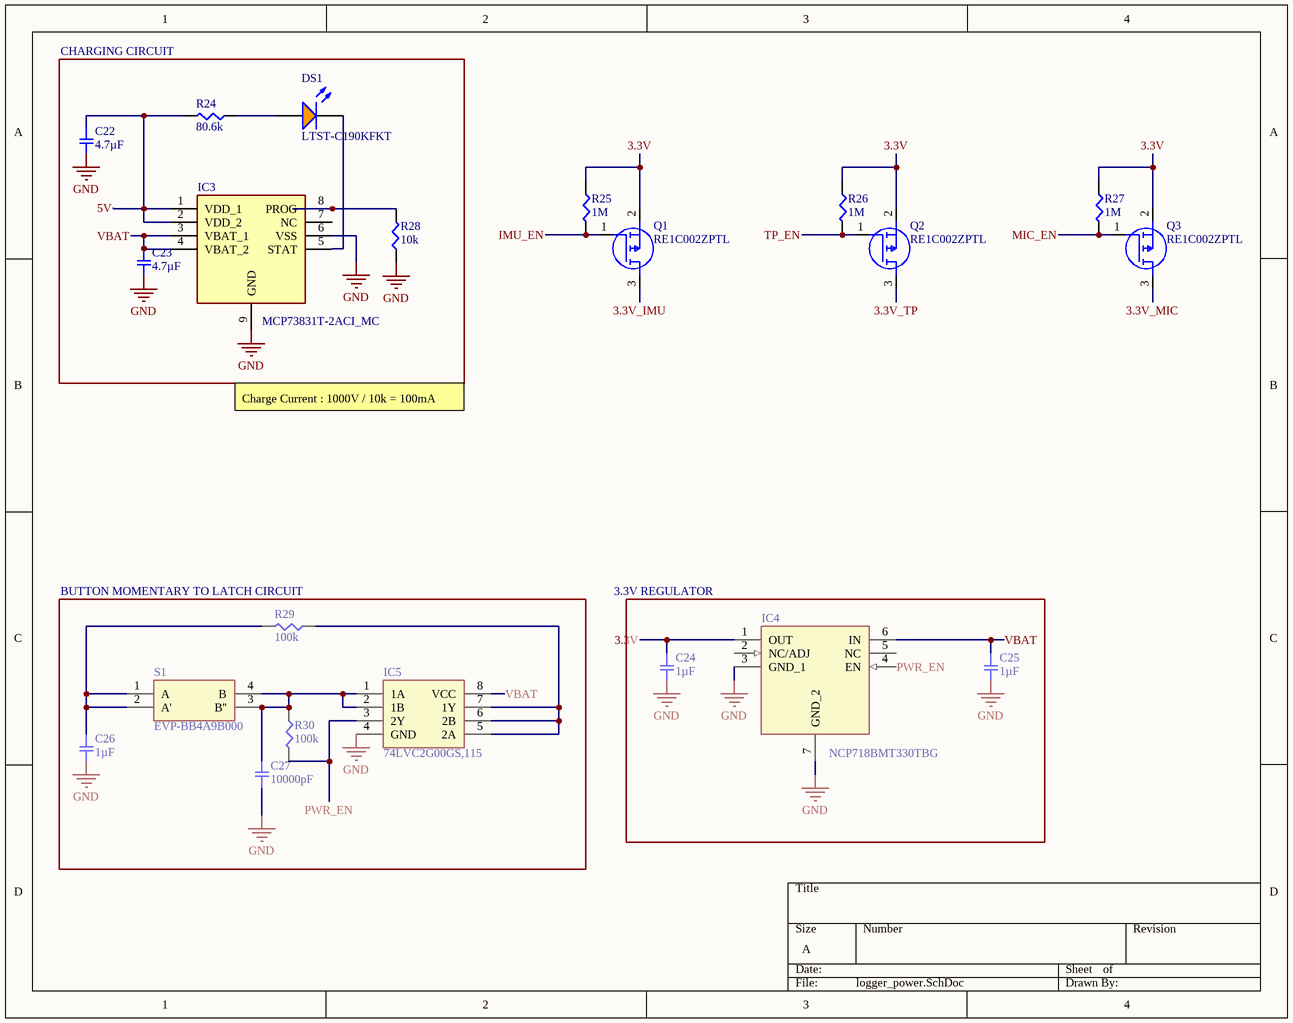
[diagram p2: logger_power.SchDoc]

### Parts
C22  4.7µF  [SMD-0402C]
C23  4.7µF  [SMD-0402C]
C24  1µF  [SMD-0402C]
C25  1µF  [SMD-0402C]
C26  1µF  [SMD-0402C]
C27  10000pF  [SMD-0402C]
DS1  LTST-C190KFKT  [LTST-C190KFKT_V]
IC3  MCP73831T-2ACI_MC  [SON65P300X300X100-9N-D]
IC4  NCP718BMT330TBG  [SON65P200X200X80-7N]
IC5  74LVC2G00GS,115  [74AXP2T3407GSX]
Q1  RE1C002ZPTL  [SOTFL50P160X85-3N]
Q2  RE1C002ZPTL  [SOTFL50P160X85-3N]
Q3  RE1C002ZPTL  [SOTFL50P160X85-3N]
R24  80.6k  [SMD-0402-RES]
R25  1M  [SMD-0402-RES]
R26  1M  [SMD-0402-RES]
R27  1M  [SMD-0402-RES]
R28  10k  [SMD-0402-RES]
R29  100k  [SMD-0402-RES]
R30  100k  [SMD-0402-RES]
S1  EVP-BB4A9B000  [EVPBB2A9B000]

### Blocks framed on the sheet
CHARGING CIRCUIT: C22 C23 DS1 IC3 R24 R28
BUTTON MOMENTARY TO LATCH CIRCUIT: C26 C27 IC5 R29 R30 S1

### Nets
GND: C22.2 C23.2 C24.2 C25.2 C26.2 C27.1 IC3.6(VSS) IC3.9(GND) IC4.3(GND_1) IC4.7(GND_2) IC5.4(GND) R28.1
3.3V: C24.1 IC4.1(OUT) Q1.2(S) Q2.2(S) Q3.2(S) R25.1 R26.1 R27.1
3.3V_IMU: Q1.3(D)
3.3V_MIC: Q3.3(D)
3.3V_TP: Q2.3(D)
5V: C22.1 IC3.1(VDD_1) IC3.2(VDD_2) R24.2
IMU_EN: Q1.1(G) R25.2
MIC_EN: Q3.1(G) R27.2
PWR_EN: IC4.4(EN) IC5.3(2Y) R30.2
TP_EN: Q2.1(G) R26.2
VBAT: C23.1 C25.1 IC3.3(VBAT_1) IC3.4(VBAT_2) IC4.6(IN) IC5.8(VCC)
NetC26_1: C26.1 R29.2 S1.1(A) S1.2(A')
NetC27_2: C27.2 IC5.1(1A) IC5.2(1B) R30.1 S1.3(B'') S1.4(B)
NetDS1_1: DS1.1(A) R24.1
NetDS1_2: DS1.2(K) IC3.5(STAT)
NetIC3_8: IC3.8(PROG) R28.2
NetIC5_5: IC5.5(2A) IC5.6(2B) IC5.7(1Y) R29.1

Not connected (* = marked no-connect by the designer): IC3 7(NC); IC4 2(NC/ADJ) 5(NC)

### Notes on the sheet
- Charge Current : 1000V / 10k = 100mA
- 3.3V REGULATOR

### Library data of the parts
C22 C23 = GRM153R60G475ME15D: CAP CER 4.7UF 4V X5R 0402; Manufacturer: Murata Electronics North America; Factory Stock: 0; Unit Price (USD): 0.27; Minimum Quantity: 1; Tolerance: ±20%; Datasheets: http://psearch.en.murata.com/capacitor/product/GRM153R60G475ME15%23.pdf; Image: //media.digikey.com/Renders/Murata%20Renders/ZRB-SERIES-0402.jpg; Digi-Key Part Number: 490-13231-1-ND; Part Number: GRM153R60G475ME15D; Quantity Available: 9100; @ qty: 0; Packaging: Cut Tape (CT); Series: GRM; Part Status: Active; Value: 4.7µF; Voltage: 4V; Temperature Coefficient: X5R; Operating Temperature: -55°C ~ 85°C; Features: -; Ratings: -; Applications: General Purpose; Mounting Type: Surface Mount, MLCC; Package / Case: 0402 (1005 Metric); Size / Dimension: 0.039" L x 0.020" W (1.00mm x 0.50mm); Height - Seated (Max): -; Thickness (Max): 0.013" (0.33mm); Lead Spacing: -; Lead Style: -
C24-C26 = GCM155C71A105KE38D: as C18 on sheet logger_sensors; Datasheets: http://www.murata.com/~/media/webrenewal/support/library/catalog/products/capacitor/mlcc/c03e.ashx; Image: //media.digikey.com/Renders/Murata%20Renders/ZRB-SERIES-0402.jpg; Digi-Key Part Number: 490-13409-1-ND; Part Number: GCM155C71A105KE38D; Quantity Available: 7240; @ qty: 0; Packaging: Cut Tape (CT); Series: GCM; Part Status: Active; Value: 1µF; Voltage: 10V; Temperature Coefficient: X7S; Operating Temperature: -55°C ~ 125°C; Features: -; Ratings: AEC-Q200; Applications: Automotive; Mounting Type: Surface Mount, MLCC; Package / Case: 0402 (1005 Metric); Size / Dimension: 0.039" L x 0.020" W (1.00mm x 0.50mm); Height - Seated (Max): -; Thickness (Max): 0.022" (0.55mm); Lead Spacing: -; Lead Style: -
C27 = GCM155R71H103KA55D: as C17 on sheet logger_sensors; Datasheets: http://www.murata.com/~/media/webrenewal/support/library/catalog/products/capacitor/mlcc/c03e.ashx; Image: //media.digikey.com/Renders/Murata%20Renders/ZRB-SERIES-0402.jpg; Digi-Key Part Number: 490-4762-1-ND; Part Number: GCM155R71H103KA55D; Quantity Available: 650067; @ qty: 0; Packaging: Cut Tape (CT); Series: GCM; Part Status: Active; Value: 10000pF; Voltage: 50V; Temperature Coefficient: X7R; Operating Temperature: -55°C ~ 125°C; Features: -; Ratings: AEC-Q200; Applications: Automotive; Mounting Type: Surface Mount, MLCC; Package / Case: 0402 (1005 Metric); Size / Dimension: 0.039" L x 0.020" W (1.00mm x 0.50mm); Height - Seated (Max): -; Thickness (Max): 0.022" (0.55mm); Lead Spacing: -; Lead Style: -
DS1 = CMP-1674-00008-1: LED Uni-Color Orange, 75 mW, 30 mA, -35 to 85 degC, 2-Pin SMD, RoHS, Tape and Reel; Resistance: 47 kohm; Power Rating: 100 mW; Case\Package: 0603; Tolerance: 1%; Voltage Rating (DC): 50 V; ComponentLink2URL: http://optoelectronics.liteon.com/upload/download/DS-22-99-0186/S_110_LTST-C190KFKT.pdf; Mount: Surface Mount; Pins: 2; Package Quantity: 5000; Max Operating Temperature: 155 degC; RoHSCompliant: true; PackageDescription: 2-Pin Surface Mount Device, Body 1.6 x 0.8 mm; Case Code (Metric): 1608; PackageReference: C190KFKT; Height: 0.45 mm; ComponentLink2Description: Datasheet; Min Operating Temperature: -55 degC; DatasheetVersion: Rev. I, 09/2011; Packaging: Tape and Reel; ComponentLink1Description: Manufacturer URL; ComponentLink1URL: http://www.us.liteon.com/; Voltage Rating: 50 V; Case Code (Imperial): 0603; Length: 1.6 mm; Width: 0.8 mm; REACH SVHC: No SVHC
IC3 = MCP73831T-2ACI_MC: Integrated Circuit; Manufacturer_Name: Microchip; Manufacturer_Part_Number: MCP73831T-2ACI/MC; Allied_Number: 70452042; Datasheet Link: http://ww1.microchip.com/downloads/en/DeviceDoc/20001984g.pdf; Height: 1mm; Mouser Part Number: 579-MCP73831T-2ACIMC; Mouser Price/Stock: https://www.mouser.com/Search/Refine.aspx?Keyword=579-MCP73831T-2ACIMC; Allied Price/Stock: https://www.alliedelec.com/microchiptechnologyinc-mcp73831t-2aci-mc/70452042/
IC4 = NCP718BMT330TBG: Integrated Circuit; Manufacturer_Name: ON Semiconductor; Datasheet Link: https://componentsearchengine.com/Datasheets/1/NCP718BMT330TBG.pdf; Height: 0.8mm; Manufacturer_Part_Number: NCP718BMT330TBG; Mouser Part Number: 863-NCP718BMT330TBG; Mouser Price/Stock: https://www.mouser.com/Search/Refine.aspx?Keyword=863-NCP718BMT330TBG; RS Part Number: 1861278; RS Price/Stock: http://uk.rs-online.com/web/p/products/1861278
IC5 = 74LVC2G00GS,115: Integrated Circuit; Manufacturer_Name: Nexperia; Datasheet Link: https://assets.nexperia.com/documents/data-sheet/74LVC2G00.pdf; Height: 0.35mm; Manufacturer_Part_Number: 74LVC2G00GS,115
Q1-Q3 = RE1C002ZPTL: MOSFET (P-Channel); Manufacturer_Name: ROHM Semiconductor; Datasheet Link: https://componentsearchengine.com/Datasheets/1/RE1C002ZPTL.pdf; Height: 0.85mm; Manufacturer_Part_Number: RE1C002ZPTL; Mouser Part Number: 755-RE1C002ZPTL; Mouser Price/Stock: https://www.mouser.com/Search/Refine.aspx?Keyword=755-RE1C002ZPTL; RS Part Number: 1486960P; RS Price/Stock: http://uk.rs-online.com/web/p/products/1486960P
R24 = ERJ-2RKF8062X: RES SMD 80.6K OHM 1% 1/10W 0402; Manufacturer: Panasonic Electronic Components; Factory Stock: 0; Unit Price (USD): 0.00496; @ qty: 1500; Minimum Quantity: 1; Power (Watts): 0.1W, 1/10W; Temperature Coefficient: ±100ppm/°C; Part Number: ERJ-2RKF8062X; Datasheets: http://industrial.panasonic.com/www-cgi/jvcr13pz.cgi?E+PZ+3+AOA0002+ERJ2RKF8062X+7+WW; Image: //media.digikey.com/Photos/Panasonic%20Photos/ERJ-PA2-Series.jpg; Digi-Key Part Number: P80.6KLCT-ND; Quantity Available: 91747; Packaging: Cut Tape (CT); Series: ERJ; Part Status: Active; Value: 80.6k; Tolerance: ±1%; Composition: Thick Film; Features: Automotive AEC-Q200; Operating Temperature: -55°C ~ 155°C; Package / Case: 0402 (1005 Metric); Supplier Device Package: 0402; Size / Dimension: 0.039" L x 0.020" W (1.00mm x 0.50mm); Height - Seated (Max): 0.016" (0.40mm); Number of Terminations: 2; Failure Rate: -
R25-R27 = ERJ-2GEJ105X: RES SMD 1M OHM 5% 1/10W 0402; Manufacturer: Panasonic Electronic Components; Factory Stock: 0; Unit Price (USD): 0.00350; @ qty: 1500; Minimum Quantity: 1; Power (Watts): 0.1W, 1/10W; Temperature Coefficient: ±200ppm/°C; Part Number: ERJ-2GEJ105X; Datasheets: http://industrial.panasonic.com/www-cgi/jvcr13pz.cgi?E+PZ+3+AOA0001+ERJ2GEJ105X+7+WW; Image: //media.digikey.com/Photos/Panasonic%20Photos/ERJ-PA2-Series.jpg; Digi-Key Part Number: P1.0MJCT-ND; Quantity Available: 1082572; Packaging: Cut Tape (CT); Series: ERJ; Part Status: Active; Value: 1M; Tolerance: ±5%; Composition: Thick Film; Features: Automotive AEC-Q200; Operating Temperature: -55°C ~ 155°C; Package / Case: 0402 (1005 Metric); Supplier Device Package: 0402; Size / Dimension: 0.039" L x 0.020" W (1.00mm x 0.50mm); Height - Seated (Max): 0.016" (0.40mm); Number of Terminations: 2; Failure Rate: -
R28 = ERJ-2GEJ103X: as R5 on sheet logger_sensors; Part Number: ERJ-2GEJ103X; Datasheets: http://industrial.panasonic.com/www-cgi/jvcr13pz.cgi?E+PZ+3+AOA0001+ERJ2GEJ103X+7+WW; Image: //media.digikey.com/Photos/Panasonic%20Photos/ERJ-PA2-Series.jpg; Digi-Key Part Number: P10KJCT-ND; Quantity Available: 2560215; Packaging: Cut Tape (CT); Series: ERJ; Part Status: Active; Value: 10k; Tolerance: ±5%; Composition: Thick Film; Features: Automotive AEC-Q200; Operating Temperature: -55°C ~ 155°C; Package / Case: 0402 (1005 Metric); Supplier Device Package: 0402; Size / Dimension: 0.039" L x 0.020" W (1.00mm x 0.50mm); Height - Seated (Max): 0.016" (0.40mm); Number of Terminations: 2; Failure Rate: -
R29 R30 = ERJ-2GEJ104X: RES SMD 100K OHM 5% 1/10W 0402; Manufacturer: Panasonic Electronic Components; Factory Stock: 0; Unit Price (USD): 0.00350; @ qty: 1500; Minimum Quantity: 1; Power (Watts): 0.1W, 1/10W; Temperature Coefficient: ±200ppm/°C; Part Number: ERJ-2GEJ104X; Datasheets: http://industrial.panasonic.com/www-cgi/jvcr13pz.cgi?E+PZ+3+AOA0001+ERJ2GEJ104X+7+WW; Image: //media.digikey.com/Photos/Panasonic%20Photos/ERJ-PA2-Series.jpg; Digi-Key Part Number: P100KJCT-ND; Quantity Available: 2387986; Packaging: Cut Tape (CT); Series: ERJ; Part Status: Active; Value: 100k; Tolerance: ±5%; Composition: Thick Film; Features: Automotive AEC-Q200; Operating Temperature: -55°C ~ 155°C; Package / Case: 0402 (1005 Metric); Supplier Device Package: 0402; Size / Dimension: 0.039" L x 0.020" W (1.00mm x 0.50mm); Height - Seated (Max): 0.016" (0.40mm); Number of Terminations: 2; Failure Rate: -
S1 = EVP-BB4A9B000: Switch; Manufacturer_Name: Panasonic; Datasheet Link: https://industrial.panasonic.com/ac/cdn/e/control/switch/light-touch/catalog/sw_lt_eng_2616s.pdf; Height: 0mm; Manufacturer_Part_Number: EVP-BB4A9B000; Mouser Part Number: 667-EVP-BB4A9B000; Mouser Price/Stock: https://www.mouser.com/Search/Refine.aspx?Keyword=667-EVP-BB4A9B000

## Sheet logger_periph.SchDoc
size A
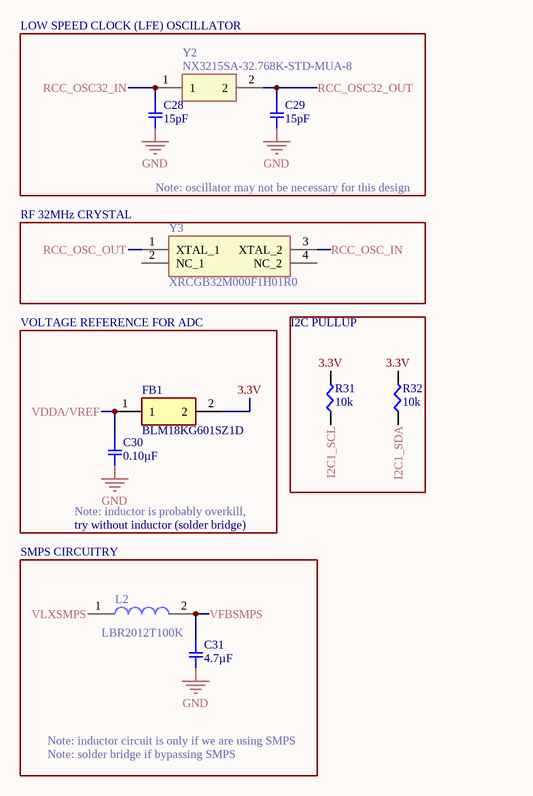
[diagram p3: logger_periph.SchDoc]

### Parts
C28  15pF  [SMD-0402C]
C29  15pF  [SMD-0402C]
C30  0.10µF  [SMD-0402C]
C31  4.7µF  [SMD-0402C]
FB1  BLM18KG601SZ1D  [BEADC1608X95N]
L2  LBR2012T100K  [INDC2012X145N]
R31  10k  [SMD-0402-RES]
R32  10k  [SMD-0402-RES]
Y2  NX3215SA-32.768K-STD-MUA-8  [NX3215SA]
Y3  XRCGB32M000F1H01R0  [XRCGB32M000F1H01R0]

### Blocks framed on the sheet
RF 32MHz CRYSTAL: Y3
I2C PULLUP: R31 R32

### Nets
GND: C28.2 C29.2 C30.2 C31.2
3.3V: FB1.2 R31.2 R32.2
I2C1_SCL: R31.1
I2C1_SDA: R32.1
RCC_OSC32_IN: C28.1 Y2.1
RCC_OSC32_OUT: C29.1 Y2.2
RCC_OSC_IN: Y3.3(XTAL_2)
RCC_OSC_OUT: Y3.1(XTAL_1)
VDDA/VREF: C30.1 FB1.1
VFBSMPS: C31.1 L2.2
VLXSMPS: L2.1

Not connected (* = marked no-connect by the designer): Y3 2(NC_1) 4(NC_2)

### Notes on the sheet
- LOW SPEED CLOCK (LFE) OSCILLATOR
- Note: oscillator may not be necessary for this design
- VOLTAGE REFERENCE FOR ADC
- (near C30) Note: inductor is probably overkill,
- try without inductor (solder bridge)
- SMPS CIRCUITRY
- Note: inductor circuit is only if we are using SMPS
- Note: solder bridge if bypassing SMPS

### Library data of the parts
C28 C29 = GCM1555C1H150JA16D: as C13 on sheet logger_sensors; Datasheets: http://www.murata.com/~/media/webrenewal/support/library/catalog/products/capacitor/mlcc/c03e.ashx; Image: //media.digikey.com/Renders/Murata%20Renders/ZRB-SERIES-0402.jpg; Digi-Key Part Number: 490-11147-1-ND; Part Number: GCM1555C1H150JA16D; Quantity Available: 6185; @ qty: 0; Packaging: Cut Tape (CT); Series: GCM; Part Status: Active; Value: 15pF; Voltage: 50V; Operating Temperature: -55°C ~ 125°C; Features: -; Ratings: AEC-Q200; Applications: Automotive; Mounting Type: Surface Mount, MLCC; Package / Case: 0402 (1005 Metric); Size / Dimension: 0.039" L x 0.020" W (1.00mm x 0.50mm); Height - Seated (Max): -; Thickness (Max): 0.022" (0.55mm); Lead Spacing: -; Lead Style: -
C30 = GCM155R71C104KA55D: as C3 on sheet logger_mcu; Datasheets: http://www.murata.com/~/media/webrenewal/support/library/catalog/products/capacitor/mlcc/c03e.ashx; Image: //media.digikey.com/Renders/Murata%20Renders/ZRB-SERIES-0402.jpg; Digi-Key Part Number: 490-4759-1-ND; Part Number: GCM155R71C104KA55D; Quantity Available: 734194; @ qty: 0; Packaging: Cut Tape (CT); Series: GCM; Part Status: Active; Value: 0.10µF; Voltage: 16V; Temperature Coefficient: X7R; Operating Temperature: -55°C ~ 125°C; Features: -; Ratings: AEC-Q200; Applications: Automotive; Mounting Type: Surface Mount, MLCC; Package / Case: 0402 (1005 Metric); Size / Dimension: 0.039" L x 0.020" W (1.00mm x 0.50mm); Height - Seated (Max): -; Thickness (Max): 0.022" (0.55mm); Lead Spacing: -; Lead Style: -
C31 = GRM153R60G475ME15D: as C22 on sheet logger_power; Datasheets: http://psearch.en.murata.com/capacitor/product/GRM153R60G475ME15%23.pdf; Image: //media.digikey.com/Renders/Murata%20Renders/ZRB-SERIES-0402.jpg; Digi-Key Part Number: 490-13231-1-ND; Part Number: GRM153R60G475ME15D; Quantity Available: 9100; @ qty: 0; Packaging: Cut Tape (CT); Series: GRM; Part Status: Active; Value: 4.7µF; Voltage: 4V; Temperature Coefficient: X5R; Operating Temperature: -55°C ~ 85°C; Features: -; Ratings: -; Applications: General Purpose; Mounting Type: Surface Mount, MLCC; Package / Case: 0402 (1005 Metric); Size / Dimension: 0.039" L x 0.020" W (1.00mm x 0.50mm); Height - Seated (Max): -; Thickness (Max): 0.013" (0.33mm); Lead Spacing: -; Lead Style: -
FB1 = BLM18KG601SZ1D: Ferrite Bead; Manufacturer_Name: Murata Electronics; Datasheet Link: http://www.murata.com/~/media/webrenewal/support/library/catalog/products/emc/emifil/c31e.ashx?la=en-gb; Height: 0.95mm; Manufacturer_Part_Number: BLM18KG601SZ1D; Mouser Part Number: 81-BLM18KG601SZ1D; Mouser Price/Stock: https://www.mouser.com/Search/Refine.aspx?Keyword=81-BLM18KG601SZ1D
L2 = LBR2012T100K: Inductor; Manufacturer_Name: TAIYO YUDEN; Datasheet Link: https://componentsearchengine.com/Datasheets/2/LBR2012T100K.pdf; Height: 1.45mm; Manufacturer_Part_Number: LBR2012T100K; Mouser Part Number: 963-LBR2012T100K; Mouser Price/Stock: https://www.mouser.com/Search/Refine.aspx?Keyword=963-LBR2012T100K
R31 R32 = ERJ-2GEJ103X: as R5 on sheet logger_sensors; Part Number: ERJ-2GEJ103X; Datasheets: http://industrial.panasonic.com/www-cgi/jvcr13pz.cgi?E+PZ+3+AOA0001+ERJ2GEJ103X+7+WW; Image: //media.digikey.com/Photos/Panasonic%20Photos/ERJ-PA2-Series.jpg; Digi-Key Part Number: P10KJCT-ND; Quantity Available: 2560215; Packaging: Cut Tape (CT); Series: ERJ; Part Status: Active; Value: 10k; Tolerance: ±5%; Composition: Thick Film; Features: Automotive AEC-Q200; Operating Temperature: -55°C ~ 155°C; Package / Case: 0402 (1005 Metric); Supplier Device Package: 0402; Size / Dimension: 0.039" L x 0.020" W (1.00mm x 0.50mm); Height - Seated (Max): 0.016" (0.40mm); Number of Terminations: 2; Failure Rate: -
Y2 = NX3215SA-32.768K-STD-MUA-8: Crystal or Oscillator; Manufacturer_Name: NDK; Datasheet Link: http://www.ndk.com/images/products/catalog/c_NX3215SA-STD-MUA-14_e.pdf; Manufacturer_Part_Number: NX3215SA-32.768K-STD-MUA-8; Mouser Part Number: 344-NX3215SA32768K8; Mouser Price/Stock: https://www.mouser.com/Search/Refine.aspx?Keyword=344-NX3215SA32768K8
Y3 = XRCGB32M000F1H01R0: Crystal or Oscillator; Manufacturer_Name: Murata Electronics; Datasheet Link: https://www.murata.com/en-eu/products/productdetail?partno=XRCGB32M000F1H01R0; Height: 0.7mm; Manufacturer_Part_Number: XRCGB32M000F1H01R0; Mouser Part Number: 81-XRCGB32M000F1H01R; Mouser Price/Stock: https://www.mouser.com/Search/Refine.aspx?Keyword=81-XRCGB32M000F1H01R

## Sheet logger_connector.SchDoc
size A
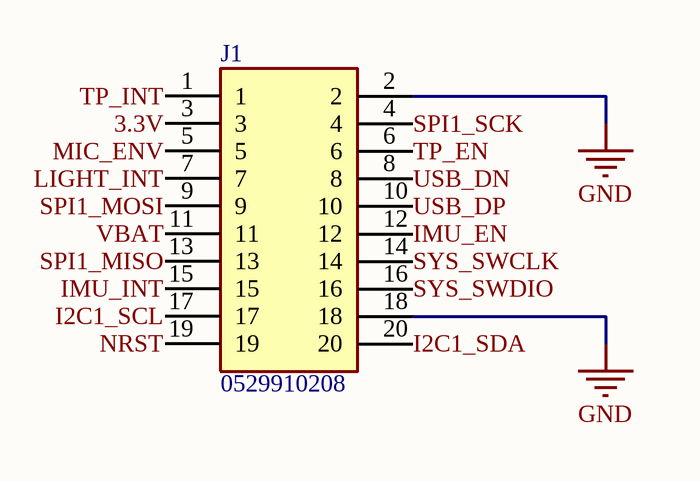
[diagram p4: logger_connector.SchDoc]

### Parts
J1  0529910208  [0529910208]

### Nets
GND: J1.2 J1.18
3.3V: J1.3
I2C1_SCL: J1.17
I2C1_SDA: J1.20
IMU_EN: J1.12
IMU_INT: J1.15
LIGHT_INT: J1.7
MIC_ENV: J1.5
NRST: J1.19
SPI1_MISO: J1.13
SPI1_MOSI: J1.9
SPI1_SCK: J1.4
SYS_SWCLK: J1.14
SYS_SWDIO: J1.16
TP_EN: J1.6
TP_INT: J1.1
USB_DN: J1.8
USB_DP: J1.10
VBAT: J1.11

### Library data of the parts
J1 = 0529910208: Connector; Manufacturer_Name: Molex; Datasheet Link: https://www.molex.com/pdm_docs/sd/529910208_sd.pdf; Height: 2.47mm; Manufacturer_Part_Number: 0529910208

## Nets that join several sheets
GND: logger_mcu (16 pins), logger_sensors (30 pins), logger_power (12 pins), logger_periph (C28.2 C29.2 C30.2 C31.2), logger_connector (J1.2 J1.18)
3.3V: logger_mcu (11 pins), logger_sensors (LED1.2 R5.2 U1.1), logger_power (8 pins), logger_periph (FB1.2 R31.2 R32.2), logger_connector (J1.3)
3.3V_MIC: logger_sensors (6 pins), logger_power (Q3.3)
3.3V_TP: logger_sensors (R7.2 U2.5), logger_power (Q2.3)
BLUE_LED: logger_mcu (IC1.11), logger_sensors (R15.2)
GREEN_LED: logger_mcu (IC1.10), logger_sensors (R14.1)
I2C1_SCL: logger_mcu (IC1.5), logger_sensors (AC1.19 U1.2 U2.7), logger_periph (R31.1), logger_connector (J1.17)
I2C1_SDA: logger_mcu (IC1.6), logger_sensors (AC1.20 U1.6 U2.6), logger_periph (R32.1), logger_connector (J1.20)
I2S_FS: logger_mcu (R3.1), logger_sensors (MK1.1)
I2S_SCK: logger_mcu (R2.1), logger_sensors (MK1.4)
I2S_SD: logger_mcu (IC1.36), logger_sensors (R10.2 R13.2)
IMU_EN: logger_mcu (IC1.46), logger_power (Q1.1 R25.2), logger_connector (J1.12)
IMU_INT: logger_mcu (IC1.9), logger_sensors (AC1.14), logger_connector (J1.15)
LIGHT_INT: logger_mcu (IC1.30), logger_sensors (R5.1 U1.5), logger_connector (J1.7)
MIC_ENV: logger_mcu (IC1.19), logger_sensors (C21.1 D2.1 R19.1 R21.1), logger_connector (J1.5)
MIC_SIG: logger_mcu (IC1.13), logger_sensors (C19.1 IC2.1 R17.1)
NRST: logger_mcu (C4.1 IC1.7), logger_connector (J1.19)
RCC_OSC32_IN: logger_mcu (IC1.2), logger_periph (C28.1 Y2.1)
RCC_OSC32_OUT: logger_mcu (IC1.3), logger_periph (C29.1 Y2.2)
RCC_OSC_IN: logger_mcu (IC1.25), logger_periph (Y3.3)
RCC_OSC_OUT: logger_mcu (IC1.24), logger_periph (Y3.1)
RED_LED: logger_mcu (IC1.14), logger_sensors (R12.1)
SPI1_MISO: logger_mcu (IC1.15), logger_connector (J1.13)
SPI1_MOSI: logger_mcu (IC1.16), logger_connector (J1.9)
SPI1_SCK: logger_mcu (IC1.43), logger_connector (J1.4)
SYS_SWCLK: logger_mcu (IC1.41), logger_connector (J1.14)
SYS_SWDIO: logger_mcu (IC1.39), logger_connector (J1.16)
TP_EN: logger_mcu (IC1.45), logger_power (Q2.1 R26.2), logger_connector (J1.6)
TP_INT: logger_mcu (IC1.29), logger_sensors (R7.1 U2.8), logger_connector (J1.1)
TSC_G2_IO1: logger_mcu (IC1.44), logger_sensors (C17.2 TP1.1)
TSC_G2_IO4: logger_mcu (IC1.47), logger_sensors (R9.1)
USB_DN: logger_mcu (IC1.37), logger_connector (J1.8)
USB_DP: logger_mcu (IC1.38), logger_connector (J1.10)
VBAT: logger_power (6 pins), logger_connector (J1.11)
VDDA/VREF: logger_mcu (IC1.8), logger_periph (C30.1 FB1.1)
VFBSMPS: logger_mcu (IC1.31), logger_periph (C31.1 L2.2)
VLXSMPS: logger_mcu (IC1.33), logger_periph (L2.1)